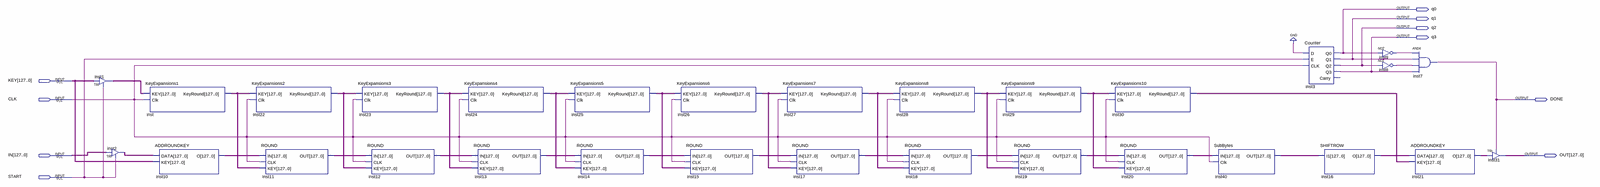
[diagram p0: schematic sheet, whole]
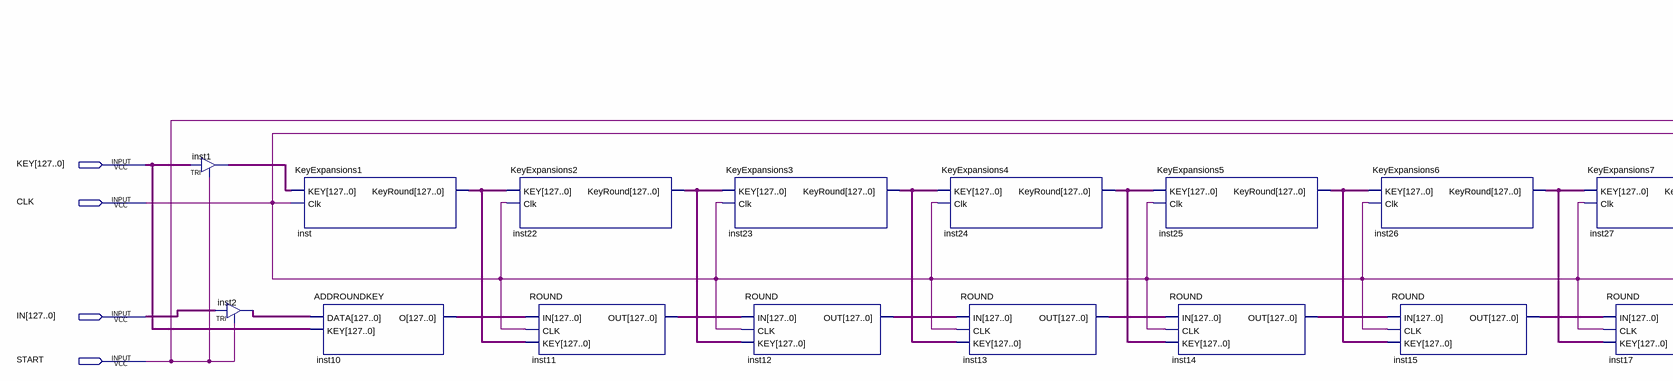
[diagram p1: schematic sheet, left part]
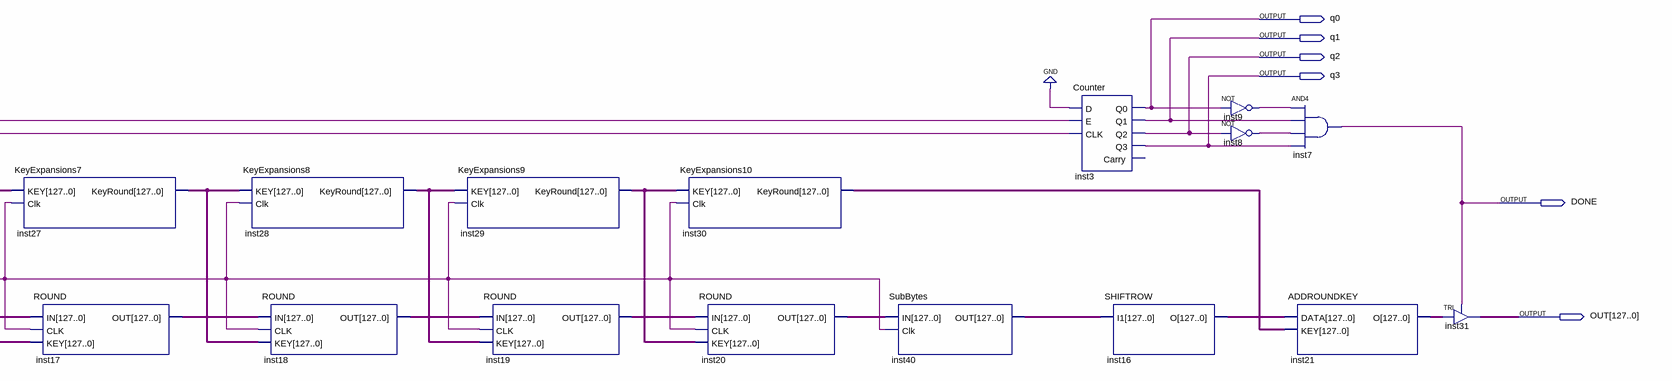
[diagram p2: schematic sheet, right part]
// Quartus schematic AES128.bdf as structural Verilog: 30 symbols, 10 pins
module AES128 (
  input  [127:0] KEY,
  input  CLK,
  input  [127:0] IN,
  input  START,
  output q0,
  output q1,
  output q2,
  output q3,
  output DONE,
  output [127:0] OUT
);

  wire inst8_out, inst9_out;
  wire [127:0] inst1_out, inst2_out, inst10_o, inst11_out, inst12_out, inst13_out, inst14_out, inst15_out,
       inst16_o, inst17_out, inst18_out, inst19_out, inst20_out, inst21_o, inst22_keyround, inst23_keyround,
       inst24_keyround, inst25_keyround, inst26_keyround, inst27_keyround, inst28_keyround, inst29_keyround,
       inst30_keyround, inst40_out, inst_keyround;

  TRI inst1[127:0] (.IN(KEY), .OE(START), .OUT(inst1_out));
  TRI inst2[127:0] (.IN(IN), .OE(START), .OUT(inst2_out));
  KeyExpansions1 inst (.KEY(inst1_out), .Clk(CLK), .KeyRound(inst_keyround));
  ADDROUNDKEY inst10 (.DATA(inst2_out), .KEY(KEY), .O(inst10_o));
  KeyExpansions2 inst22 (.KEY(inst_keyround), .Clk(CLK), .KeyRound(inst22_keyround));
  ROUND inst11 (.IN(inst10_o), .CLK(CLK), .KEY(inst_keyround), .OUT(inst11_out));
  KeyExpansions3 inst23 (.KEY(inst22_keyround), .Clk(CLK), .KeyRound(inst23_keyround));
  ROUND inst12 (.IN(inst11_out), .CLK(CLK), .KEY(inst22_keyround), .OUT(inst12_out));
  KeyExpansions4 inst24 (.KEY(inst23_keyround), .Clk(CLK), .KeyRound(inst24_keyround));
  ROUND inst13 (.IN(inst12_out), .CLK(CLK), .KEY(inst23_keyround), .OUT(inst13_out));
  KeyExpansions5 inst25 (.KEY(inst24_keyround), .Clk(CLK), .KeyRound(inst25_keyround));
  ROUND inst14 (.IN(inst13_out), .CLK(CLK), .KEY(inst24_keyround), .OUT(inst14_out));
  KeyExpansions6 inst26 (.KEY(inst25_keyround), .Clk(CLK), .KeyRound(inst26_keyround));
  ROUND inst15 (.IN(inst14_out), .CLK(CLK), .KEY(inst25_keyround), .OUT(inst15_out));
  KeyExpansions7 inst27 (.KEY(inst26_keyround), .Clk(CLK), .KeyRound(inst27_keyround));
  ROUND inst17 (.IN(inst15_out), .CLK(CLK), .KEY(inst26_keyround), .OUT(inst17_out));
  KeyExpansions8 inst28 (.KEY(inst27_keyround), .Clk(CLK), .KeyRound(inst28_keyround));
  ROUND inst18 (.IN(inst17_out), .CLK(CLK), .KEY(inst27_keyround), .OUT(inst18_out));
  KeyExpansions9 inst29 (.KEY(inst28_keyround), .Clk(CLK), .KeyRound(inst29_keyround));
  ROUND inst19 (.IN(inst18_out), .CLK(CLK), .KEY(inst28_keyround), .OUT(inst19_out));
  KeyExpansions10 inst30 (.KEY(inst29_keyround), .Clk(CLK), .KeyRound(inst30_keyround));
  ROUND inst20 (.IN(inst19_out), .CLK(CLK), .KEY(inst29_keyround), .OUT(inst20_out));
  SubBytes inst40 (.IN(inst20_out), .Clk(CLK), .OUT(inst40_out));
  Counter inst3 (.D(1'b0), .E(START), .CLK(CLK), .Q0(q0), .Q1(q1), .Q2(q2), .Q3(q3));  // open: Carry
  SHIFTROW inst16 (.I1(inst40_out), .O(inst16_o));
  not inst9 (inst9_out, q0);
  not inst8 (inst8_out, q2);
  and inst7 (DONE, inst9_out, q1, inst8_out, q3);
  ADDROUNDKEY inst21 (.DATA(inst16_o), .KEY(inst30_keyround), .O(inst21_o));
  TRI inst31[127:0] (.IN(inst21_o), .OE(DONE), .OUT(OUT));
endmodule
